# Altium schematic sheet 3V3.SchDoc
size A; DocumentNumber: 5; SheetNumber: 5; SheetTotal: 6
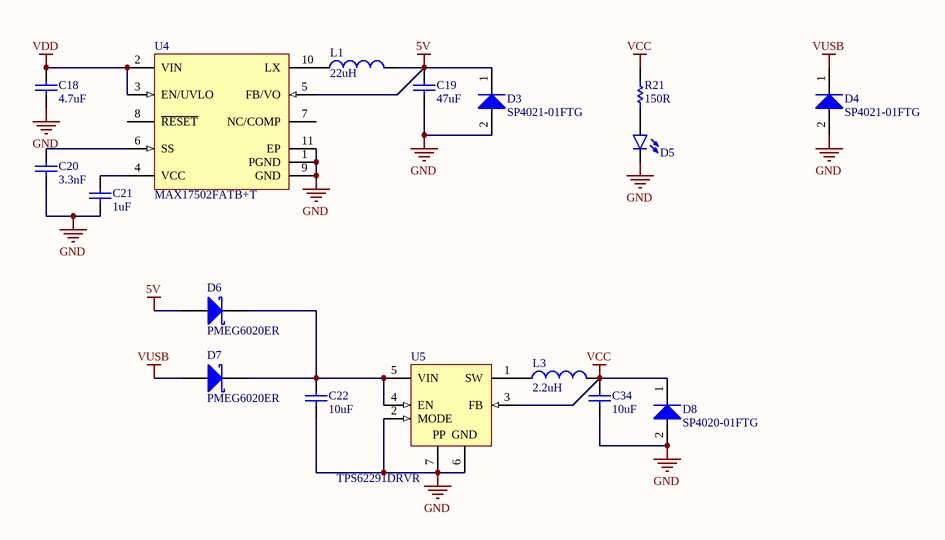
[diagram p0: 3V3.SchDoc]

## Parts
C18  value 4.7uF  [C1210[3225X200]]  (hidden comment: 4.7uF 100V 1210)
C19  value 47uF  [C1210[3225X250]]  (hidden comment: 47uF 6.3V 1210)
C20  value 3.3nF  [C0402[1005X55]]  (hidden comment: 3.3nF 50V 0402)
C21  value 1uF  [C0402[1005X55]]  (hidden comment: 1uF 6.3V 0402)
C22  value 10uF  [C0402[1005X55]]  (hidden comment: 10uF 6.3V 0402)
C34  value 10uF  [C0402[1005X55]]  (hidden comment: 10uF 6.3V 0402)
D3  SP4021-01FTG  [SOD323]
D4  SP4021-01FTG  [SOD323]
D5  LED-BLUE  [LED0603]  (value not drawn)
D6  PMEG6020ER  [ONSC-SOD-123-2-425-04_V]
D7  PMEG6020ER  [ONSC-SOD-123-2-425-04_V]
D8  SP4020-01FTG  [SOD323]
L1  value 22uH  [SDR0805-180ML]
L3  2.2uH  [IND0805]
R21  value 150R  [R0402[1005]]  (hidden comment: 150R 1% 0402)
U4  MAX17502FATB+T  [TDFN-10-EP]
U5  TPS62291DRVR  [WSON-6]

## Nets
5V: C19.2 D3.1(K) D6.2(A) L1.2 U4.5(FB/VO)
GND: C18.1 C19.1 C20.1 C21.1 C22.1 C34.1 D3.2(A) D4.2(A) D5.C D8.2(A) U4.1(PGND) U4.9(GND) U4.11(EP) U5.2(MODE) U5.6(GND) U5.7(EP)
VCC: C34.2 D8.1(K) L3.2 R21.2 U5.3(FB)
VDD: C18.2 U4.2(VIN) U4.3(EN/UVLO)
VUSB: D4.1(K) D7.2(A)
NetC20_2: C20.2 U4.6(SS)
NetC21_2: C21.2 U4.4(VCC)
NetC22_2: C22.2 D6.1(K) D7.1(K) U5.4(EN) U5.5(VIN)
NetD5_A: D5.A R21.1
NetL1_1: L1.1 U4.10(LX)
NetL3_1: L3.1 U5.1(SW)

Not connected (* = marked no-connect by the designer): U4 7(NC/COMP) 8(~{RESET})

## Notes on the sheet
- (in symbol TPS62291DRVR) PP

## Library data of the parts
C18 = CAP_4.7uF_100V_1210_10%: 4.7uF 100V 10% 1210 (3225 Metric); PartNumber: GRJ32DC72A475KE11L; Manufacturer: Murata; Tolerance: 10%; Mounting Technology: Surface Mount; PackageReference: 1210; PackageDescription: 1210 (3225 Metric); Voltage: 100V
C19 = CAP_47uF_6.3V_1210_10%: 47uF 6.3V 10% 1210 (3225 Metric); PartNumber: GRM32ER70J476KE20L; Manufacturer: Murata; Tolerance: 10%; Mounting Technology: Surface Mount; PackageReference: 1210; PackageDescription: 1210 (3225 Metric); Voltage: 6.3V
C20 = CAP_3.3nF_50V_0402_10%: 3.3nF 50V 10% 0402 (1005 Metric); PartNumber: GRM155R71H332KA01D; Manufacturer: Murata; Tolerance: 10%; Mounting Technology: Surface Mount; PackageReference: 0402; PackageDescription: 0402 (1005 Metric); Voltage: 50V
C21 = CAP_1uF_6.3V_0402_10%: 1uF 6.3V 10% 0402 (1005 Metric); PartNumber: GRM155R70J105KA12D; Manufacturer: Murata; Tolerance: 10%; Mounting Technology: Surface Mount; PackageReference: 0402; PackageDescription: 0402 (1005 Metric); Voltage: 6.3V
C22 C34 = CAP_10uF_6.3V_0402_20%: 10uF 6.3V 20% 0402 (1005 Metric); PartNumber: GRM155R60J106ME44D; Manufacturer: Murata; Tolerance: 20%; Mounting Technology: Surface Mount; PackageReference: 0402; PackageDescription: 0402 (1005 Metric); Voltage: 6.3V
D3 D4 = SP4021-01FTG: Manufacturer: Littelfuse; PartNumber: SP4021-01FTG; PackageReference: SOD-323-2; Mounting Technology: Surface Mount
D5 = LED_0603_BLUE_5mA: PartNumber: LTST-C193TBKT-5A; Manufacturer: Lite-On Inc.; PackageReference: 0603; PackageDescription: 0603 (1608 Metric); Mounting Technology: Surface Mount
D6 D7 = PMEG6020ER: PartNumber: PMEG6020ER,115; Manufacturer: NXP Semiconductors; PackageReference: SOD-123W; PackageDescription: SOD, 2-Leads, Body 2.69x1.6mm; Mounting Technology: Surface Mount
D8 = SP4020-01FTG: Manufacturer: Littelfuse; PartNumber: SP4020-01FTG; PackageReference: SOD-323-2; Mounting Technology: Surface Mount
L1 = SDR0604-220YL: 22uH 30% 1.1A 0604; Manufacturer: Bourns; PackageReference: SDR0604; PartNumber: SDR0604-220YL; Mounting Technology: Surface Mount
L3 = IND_2.2uH_1.7A_0805_20%: 2.2uH 20% 1.7A 0805; PartNumber: LQM21PN2R2MGHL; Manufacturer: Murata; PackageReference: 0805; PackageDescription: 0805 (2012 metric); Value: 2.2uH; Mounting Technology: Surface Mount; Current: 1.7A
R21 = RES_150R_0402_1%: 150R 0.063W 1% 0402 (1005 Metric); Manufacturer: KOA Speer; PartNumber: RK73H1ETTP1500F; Power: 0.063W; Tolerance: 1%; Mounting Technology: Surface Mount; PackageReference: 0402; PackageDescription: 0402 (1005 Metric); ComponentLink1Description: Datasheet; ComponentLink1URL: http://www.koaspeer.com/catimages/Products/RK73H/RK73H.pdf
U4 = MAX17502FATB+T: Manufacturer: Maxim Integrated; Mounting Technology: Surface Mount; PartNumber: MAX17502FATB+T; PackageReference: TDFN-10-EP
U5 = TPS62291DRVR: Voltage Regulators - Switching Regulators 2.25MHz 1A Step-Down Cnvrtr 3.3V Output; Manufacturer: Texas Instruments; PartNumber: TPS62291DRVR; PackageReference: WSON-6; PackageDescription: SON, 6-Leads, Body 2x2mm, Pitch 0.65mm, Thermal Pad 1.6x1mm, TI Recommended; Mounting Technology: Surface Mount